# EAGLE design IRTHERMV1.1 (EAGLE 7.2.0)
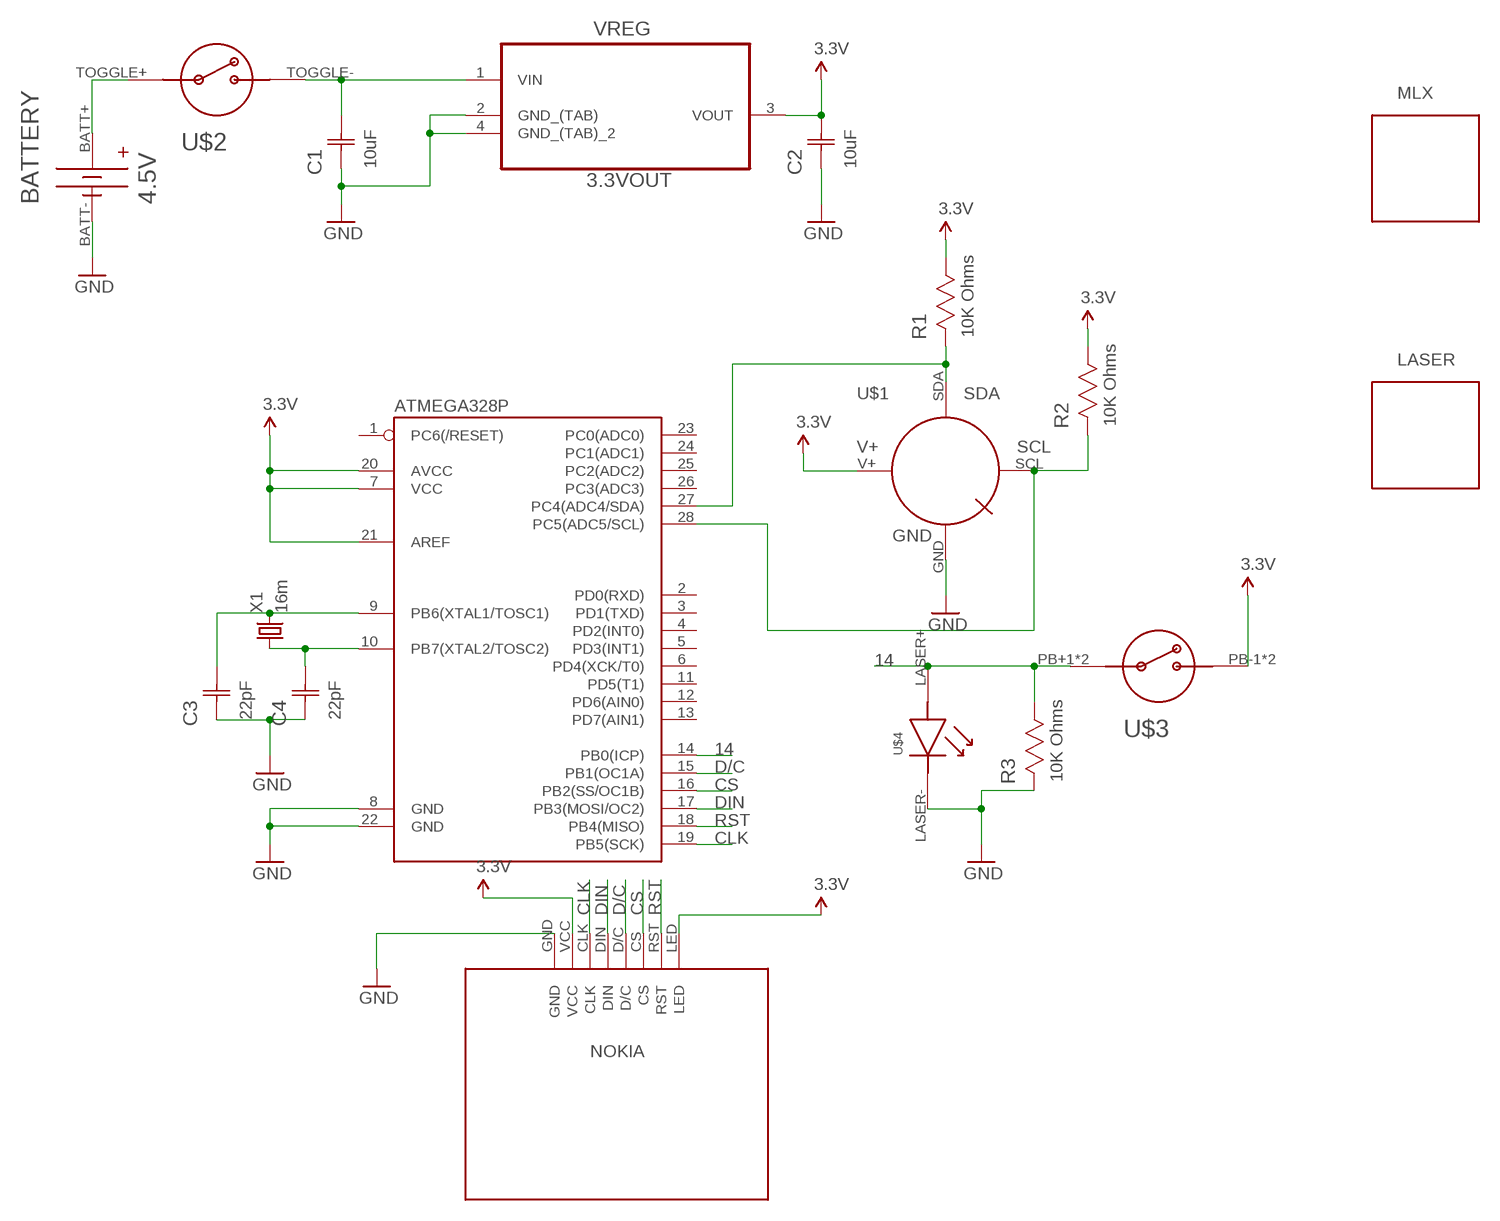
[diagram p0: schematic, sheet 1]

## Parts
ATMEGA328P  ATMEGA328P_PDIP  [DIL28-3]
BATTERY  4.5V  KEYSTONE2479  [KEYSTONE2479]
C1  10uF  C1206C106K4RACTU  [CAPC3216X180N]
C2  10uF  C1206C106K4RACTU  [CAPC3216X180N]
C3  22pF  C1206C220J5GACTU  [CAPC3216X88N]
C4  22pF  C1206C220J5GACTU  [CAPC3216X88N]
LASER  KEYSTONECLIP  [KEYSTONE50]
MLX  KEYSTONECLIP  [KEYSTONE50]
R1  10K Ohms  CRCW120610K0JNEA  [RESC3216X71N]
R2  10K Ohms  CRCW120610K0JNEA  [RESC3216X71N]
R3  10K Ohms  CRCW120610K0JNEA  [RESC3216X71N]
U$1  MLX90614  [MLX90614]
U$2  1683ON-OFFTOGGLE  [1683ON-OFFTOGGLE]
U$3  1009PUSHBUTTON  [1009PUSHBUTTON]
U$4  LASER  [LASER]
U$5  NOKIA  [NOKIA]
VREG  3.3VOUT  MCP1824ST-3302E/DB  [SOT230P700X180-4N]
X1  16m  CRYSTALHC49US  [HC49US]

## Nets
3.3V: ATMEGA328P.7(VCC) ATMEGA328P.20(AVCC) ATMEGA328P.21(AREF) C2.2(C2) R1.1 R2.1 U$1.V+(MLXV+) U$3.PB-1(ONOFF-) U$3.PB-2(ONOFF-) U$5.LED U$5.VCC VREG.3(VOUT)
14: ATMEGA328P.14(PB0(ICP)) R3.1 U$3.PB+1(ONOFF+) U$3.PB+2(ONOFF+) U$4.LASER+
CLK: ATMEGA328P.19(PB5(SCK)) U$5.CLK
CS: ATMEGA328P.16(PB2(SS/OC1B)) U$5.CS
D/C: ATMEGA328P.15(PB1(OC1A)) U$5.D/C
DIN: ATMEGA328P.17(PB3(MOSI/OC2)) U$5.DIN
GND: ATMEGA328P.8(GND) ATMEGA328P.22(GND) BATTERY.BATT- C1.1(C1) C2.1(C1) C3.1(C1) C4.1(C1) R3.2 U$1.GND(MLXGND) U$4.LASER-(LASERGND) U$5.GND VREG.2(GND_(TAB)) VREG.4(GND_(TAB)_2)
N$1: BATTERY.BATT+ U$2.TOGGLE+(ONOFF+)
N$2: C1.2(C2) U$2.TOGGLE-(ONOFF-) VREG.1(VIN)
N$5: ATMEGA328P.27(PC4(ADC4/SDA)) R1.2 U$1.SDA(MLXSDA)
N$6: ATMEGA328P.28(PC5(ADC5/SCL)) R2.2 U$1.SCL(MLXSCL)
N$8: ATMEGA328P.9(PB6(XTAL1/TOSC1)) C3.2(C2) X1.2
N$9: ATMEGA328P.10(PB7(XTAL2/TOSC2)) C4.2(C2) X1.1
RST: ATMEGA328P.18(PB4(MISO)) U$5.RST
Unconnected: ATMEGA328P.1(PC6(/RESET)) ATMEGA328P.2(PD0(RXD)) ATMEGA328P.3(PD1(TXD)) ATMEGA328P.4(PD2(INT0)) ATMEGA328P.5(PD3(INT1)) ATMEGA328P.6(PD4(XCK/T0)) ATMEGA328P.11(PD5(T1)) ATMEGA328P.12(PD6(AIN0)) ATMEGA328P.13(PD7(AIN1)) ATMEGA328P.23(PC0(ADC0)) ATMEGA328P.24(PC1(ADC1)) ATMEGA328P.25(PC2(ADC2)) ATMEGA328P.26(PC3(ADC3))

## Library data of the parts
ATMEGA328P = SparkFun-DigitalIC:ATMEGA328P_PDIP: uC used in the Arduino 32kb flash, 1k EEPROM, 2k SRAM This is the through-hole version of this chip.
BATTERY = IRTHERM:KEYSTONE2479
C1 C2 = Kemet_By_element14_Batch_1:C1206C106K4RACTU: CAPACITOR, 1206; MPN: C1206C106K4RACTU; OC_FARNELL: 1463368; OC_NEWARK: 70K9170; SUPPLIER: Kemet; TOLERANCE: ±10%; VOLTAGERATING: 16V
C3 C4 = Kemet_By_element14_Batch_1:C1206C220J5GACTU: CAPACITOR, 1206; MPN: C1206C220J5GACTU; OC_FARNELL: 1414717; OC_NEWARK: 70K9304; SUPPLIER: Kemet; TOLERANCE: ±5%; VOLTAGERATING: 50V
LASER MLX = IRTHERM:KEYSTONECLIP
R1-R3 = Vishay_By_element14_Batch_1:CRCW120610K0JNEA: RESISTOR, 1206; MPN: CRCW120610K0JNEA; OC_FARNELL: 1469655; OC_NEWARK: 42K4755; SUPPLIER: Vishay; TOLERANCE: ±5%; WATTAGE: 0.25W
U$1 = IRTHERM:MLX90614
U$2 = IRTHERM:1683ON-OFFTOGGLE
U$3 = IRTHERM:1009PUSHBUTTON
U$4 = IRTHERM:LASER
U$5 = IRTHERM:NOKIA
VREG = Microchip:MCP1824ST-3302E/DB: IC, LDO VOLT REG, 3.3V, 0.3A,; MPN: MCP1824ST-3302E/DB; OC_FARNELL: 1578379; OC_NEWARK: 05N1293; PACKAGE: SOT-223-3; SUPPLIER: Microchip
X1 = SparkFun-FreqCtrl:CRYSTAL: Various standard crystals. Proven footprints.

## Board
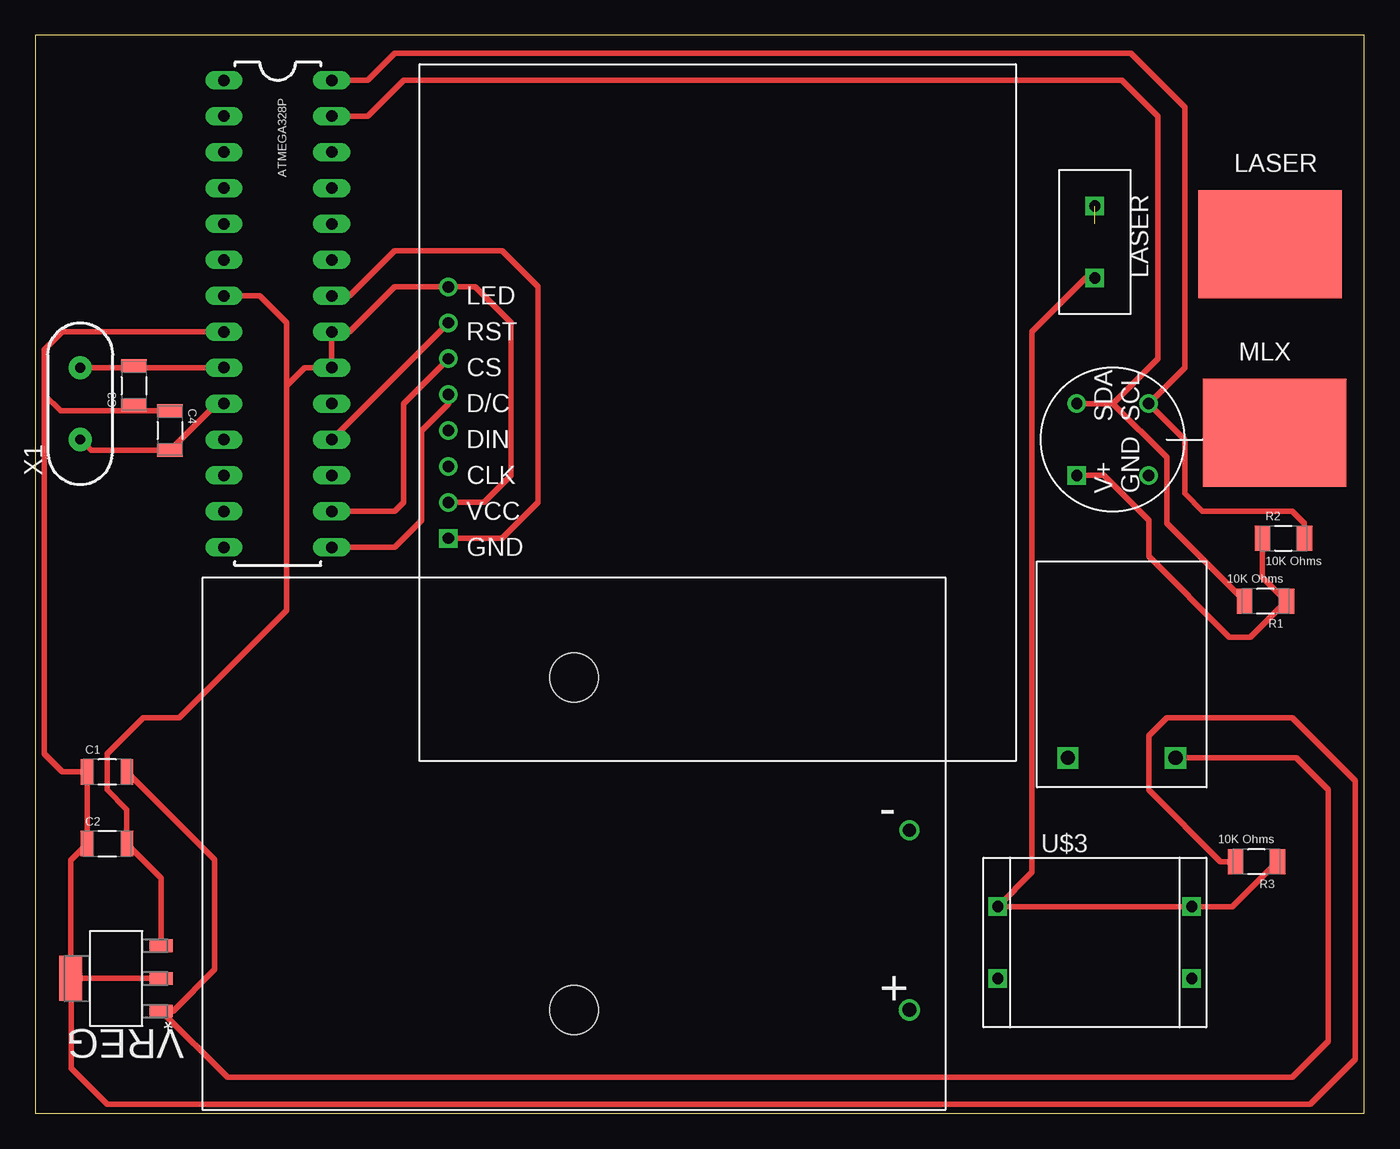
[diagram p1: board, top side]
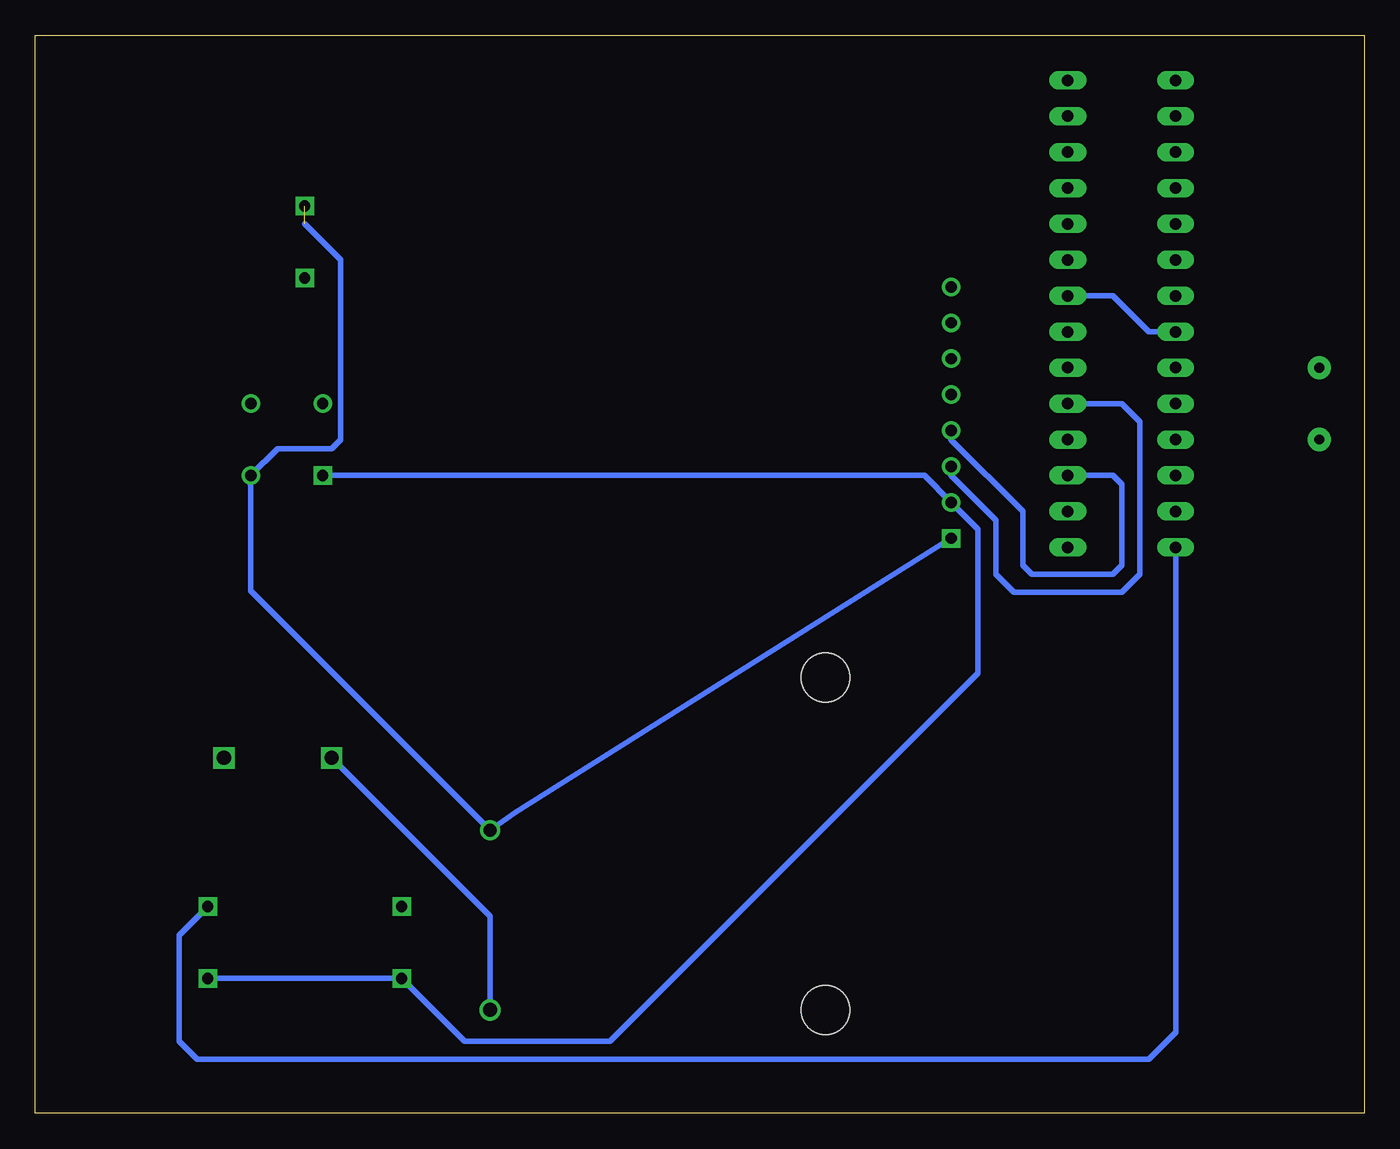
[diagram p2: board, bottom side, seen from below]

Size 93.98 x 76.2 mm. Coordinates in mm from the lower left corner, seen from the top.
Outline: 0,0 93.98,0 93.98,76.2 0,76.2 0,0
Copper layers (1*16): Top 0.035mm / dielectric 1.5mm / Bottom 0.035mm
Design rules "dirt_cheap_dirty_boards.v1": minimum track width 5mil, minimum drill 12mil, track to track 5mil, track to pad 5mil, pad to pad 5mil, via to via 5mil, smd to smd 0mil, copper to edge 10mil, drill to drill 10mil, minimum pad ring 10mil, minimum via ring 6mil, stop-mask expansion 2mil, vias tented up to drill 25mil, thermal gap 10mil

### Footprints (pad centres in the part's own frame; a part is rotated, then mirrored left to right if it is on the bottom)
DIL28-3 = drill 0.813 long: 1 -16.51,-3.81; 2 -13.97,-3.81; 3 -11.43,-3.81; 4 -8.89,-3.81; 5 -6.35,-3.81; 6 -3.81,-3.81; 7 -1.27,-3.81; 8 1.27,-3.81; 9 3.81,-3.81; 10 6.35,-3.81; 11 8.89,-3.81; 12 11.43,-3.81; 13 13.97,-3.81; 14 16.51,-3.81; 15 16.51,3.81; 16 13.97,3.81; 17 11.43,3.81; 18 8.89,3.81; 19 6.35,3.81; 20 3.81,3.81; 21 1.27,3.81; 22 -1.27,3.81; 23 -3.81,3.81; 24 -6.35,3.81; 25 -8.89,3.81; 26 -11.43,3.81; 27 -13.97,3.81; 28 -16.51,3.81
KEYSTONE2479 = drill 1: BATT+ 23.724,-11.748 | drill 0.9: BATT- 23.724,0.953 | hole 3.454: 0,11.748; 0,-11.748
CAPC3216X180N = smd 0.914 x 1.803: 1 -1.397,0; 2 1.397,0
CAPC3216X88N = smd 0.914 x 1.803: 1 -1.397,0; 2 1.397,0
KEYSTONE50 = smd 10.16 x 7.62: P$1 0,0
RESC3216X71N = smd 1.118 x 1.753: 1 -1.473,0; 2 1.473,0
MLX90614 = drill 0.8: GND -2.54,-2.54; SCL 2.54,-2.54; SDA 2.54,2.54 | drill 0.8 square: V+ -2.54,2.54
1683ON-OFFTOGGLE = drill 1 square: TOGGLE+ -3.81,-7.899; TOGGLE- 3.81,-7.899
1009PUSHBUTTON = drill 0.8 square: PB+1 -6.858,2.54; PB+2 6.858,2.54; PB-1 -6.858,-2.54; PB-2 6.858,-2.54
LASER = drill 0.8 square: LASER+ -2.54,0; LASER- 2.54,0
NOKIA = drill 0.8: CLK -3.81,19.05; CS 3.81,19.05; D/C 1.27,19.05; DIN -1.27,19.05; LED 8.89,19.05; RST 6.35,19.05; VCC -6.35,19.05 | drill 0.8 square: GND -8.89,19.05
SOT230P700X180-4N = smd 1.626 x 0.889: 1 -3.2,2.311; 2 -3.2,0; 3 -3.2,-2.311 | smd 1.626 x 3.175: 4 3.2,0
HC49US = drill 0.7 pad 1.651: 1 -2.54,0; 2 2.54,0

### Placement (x,y rotation side)
ATMEGA328P  17.14,56.52 270 top
BATTERY  38.1,19.05 0 top
C1  5.08,24.13 0 top
C2  5.08,19.05 0 top
C3  6.99,51.44 90 top
C4  9.53,48.26 270 top
LASER  87.33,61.44 0 top
MLX  87.64,48.1 0 top
R1  87,36.2 180 top
R2  88.27,40.64 0 top
R3  86.36,17.78 180 top
U$1  76.2,47.62 90 top
U$2  76.83,33.02 0 top
U$3  74.93,12.06 0 top
U$4  74.93,61.59 90 top
U$5  48.26,49.53 90 top
VREG  5.71,9.53 180 top
X1  3.17,50.16 90 top

### Tracks (layer width: path | path; a pad name or v marks a point on that pad's centre or on a via)
3.3V
  Top 0.406: VREG.3 8.91,16.61 C2.2 6.48,21.46 5.08,22.86 5.08,25.4 7.62,27.94 10.16,27.94 17.78,35.56 17.78,51.44 | ATMEGA328P.7 15.88,57.78 17.78,55.88 17.78,51.44 | R2.1 86.79,37.87 R1.1 85.93,33.66 84.45,33.66 78.74,39.37 78.74,41.91 75.56,45.09 U$1.V+ | 17.78,51.44 19.05,52.7 ATMEGA328P.20 ATMEGA328P.21 22.23,55.24 25.4,58.42 U$5.LED 31.11,58.42 33.66,55.88 33.66,45.09 31.75,43.18 U$5.VCC
  Bottom 0.406: U$1.V+ 31.11,45.09 U$5.VCC 27.3,41.27 27.3,31.11 53.34,5.08 63.63,5.08 U$3.PB-1 U$3.PB-2
14
  Top 0.406: R3.1 84.66,14.61 U$3.PB+2 U$3.PB+1 70.48,17.02 70.48,55.24 74.3,59.05 U$4.LASER+
  Bottom 0.406: ATMEGA328P.14 13.34,5.71 15.24,3.81 82.55,3.81 83.82,5.08 83.82,12.57 U$3.PB+2
CLK
  Bottom 0.406: U$5.CLK 29.21,45.09 26.04,41.91 26.04,38.1 24.77,36.83 17.14,36.83 15.88,38.1 15.88,48.9 17.14,50.16 ATMEGA328P.19
CS
  Top 0.406: U$5.CS 26.04,50.16 26.04,43.18 25.4,42.55 ATMEGA328P.16
D/C
  Top 0.406: U$5.D/C 29.21,50.16 27.3,48.26 27.3,41.91 25.4,40.01 ATMEGA328P.15
DIN
  Bottom 0.406: U$5.DIN 29.21,47.62 24.13,42.55 24.13,38.73 23.5,38.1 17.78,38.1 17.14,38.73 17.14,44.45 17.78,45.09 ATMEGA328P.17
GND  (1 unrouted)
  Top 0.406: VREG.2 3.17,9.53 | 3.17,9.53 VREG.4 2.52,17.88 C2.1 C1.1 1.91,24.13 0.64,25.4 0.64,50.8 | C4.1 7.37,49.66 | 7.37,49.66 C3.1 | 7.37,49.66 1.78,49.66 0.64,50.8 | 0.64,50.8 0.64,53.98 1.91,55.24 ATMEGA328P.8 | ATMEGA328P.22 22.23,57.78 25.4,60.96 33.02,60.96 35.56,58.42 35.56,43.18 33.02,40.64 U$5.GND | 3.17,9.53 2.54,8.89 2.54,3.17 5.08,0.64 90.17,0.64 93.34,3.81 93.34,23.5 88.9,27.94 80.01,27.94 78.74,26.67 78.74,22.86 83.82,17.78 R3.2
  Bottom 0.406: ATMEGA328P.8 15.24,55.24 17.78,57.78 ATMEGA328P.22 | 74.93,62.87 72.39,60.33 72.39,47.62 73.03,46.99 76.83,46.99 U$1.GND 78.74,36.92 BATTERY.BATT- 60.01,21.27 U$5.GND
N$1
  Bottom 0.406: BATTERY.BATT+ 61.82,13.92 U$2.TOGGLE+
N$2
  Top 0.406: U$2.TOGGLE- 89.18,25.12 91.44,22.86 91.44,5.08 88.9,2.54 13.59,2.54 VREG.1 9.75,7.21 12.7,10.16 12.7,17.91 C1.2
N$5
  Top 0.406: U$1.SDA 76.2,50.16 | 76.2,50.16 80.01,46.35 80.01,41.71 R1.2 | ATMEGA328P.27 23.5,70.48 26.04,73.03 76.83,73.03 79.38,70.48 79.38,53.34 76.2,50.16
N$6
  Top 0.406: ATMEGA328P.28 23.5,73.03 25.4,74.93 77.47,74.93 81.28,71.12 81.28,52.7 U$1.SCL 81.28,47.62 81.28,43.81 82.55,42.55 88.9,42.55 89.74,41.71 R2.2
N$8
  Top 0.406: ATMEGA328P.9 7.11,52.7 C3.2 6.86,52.7 X1.2
N$9
  Top 0.406: ATMEGA328P.10 12.83,50.16 C4.2 3.94,46.86 X1.1
RST
  Top 0.406: U$5.RST ATMEGA328P.18